# EAGLE design HMC5883L_Breakout-v14 (EAGLE 6.2)
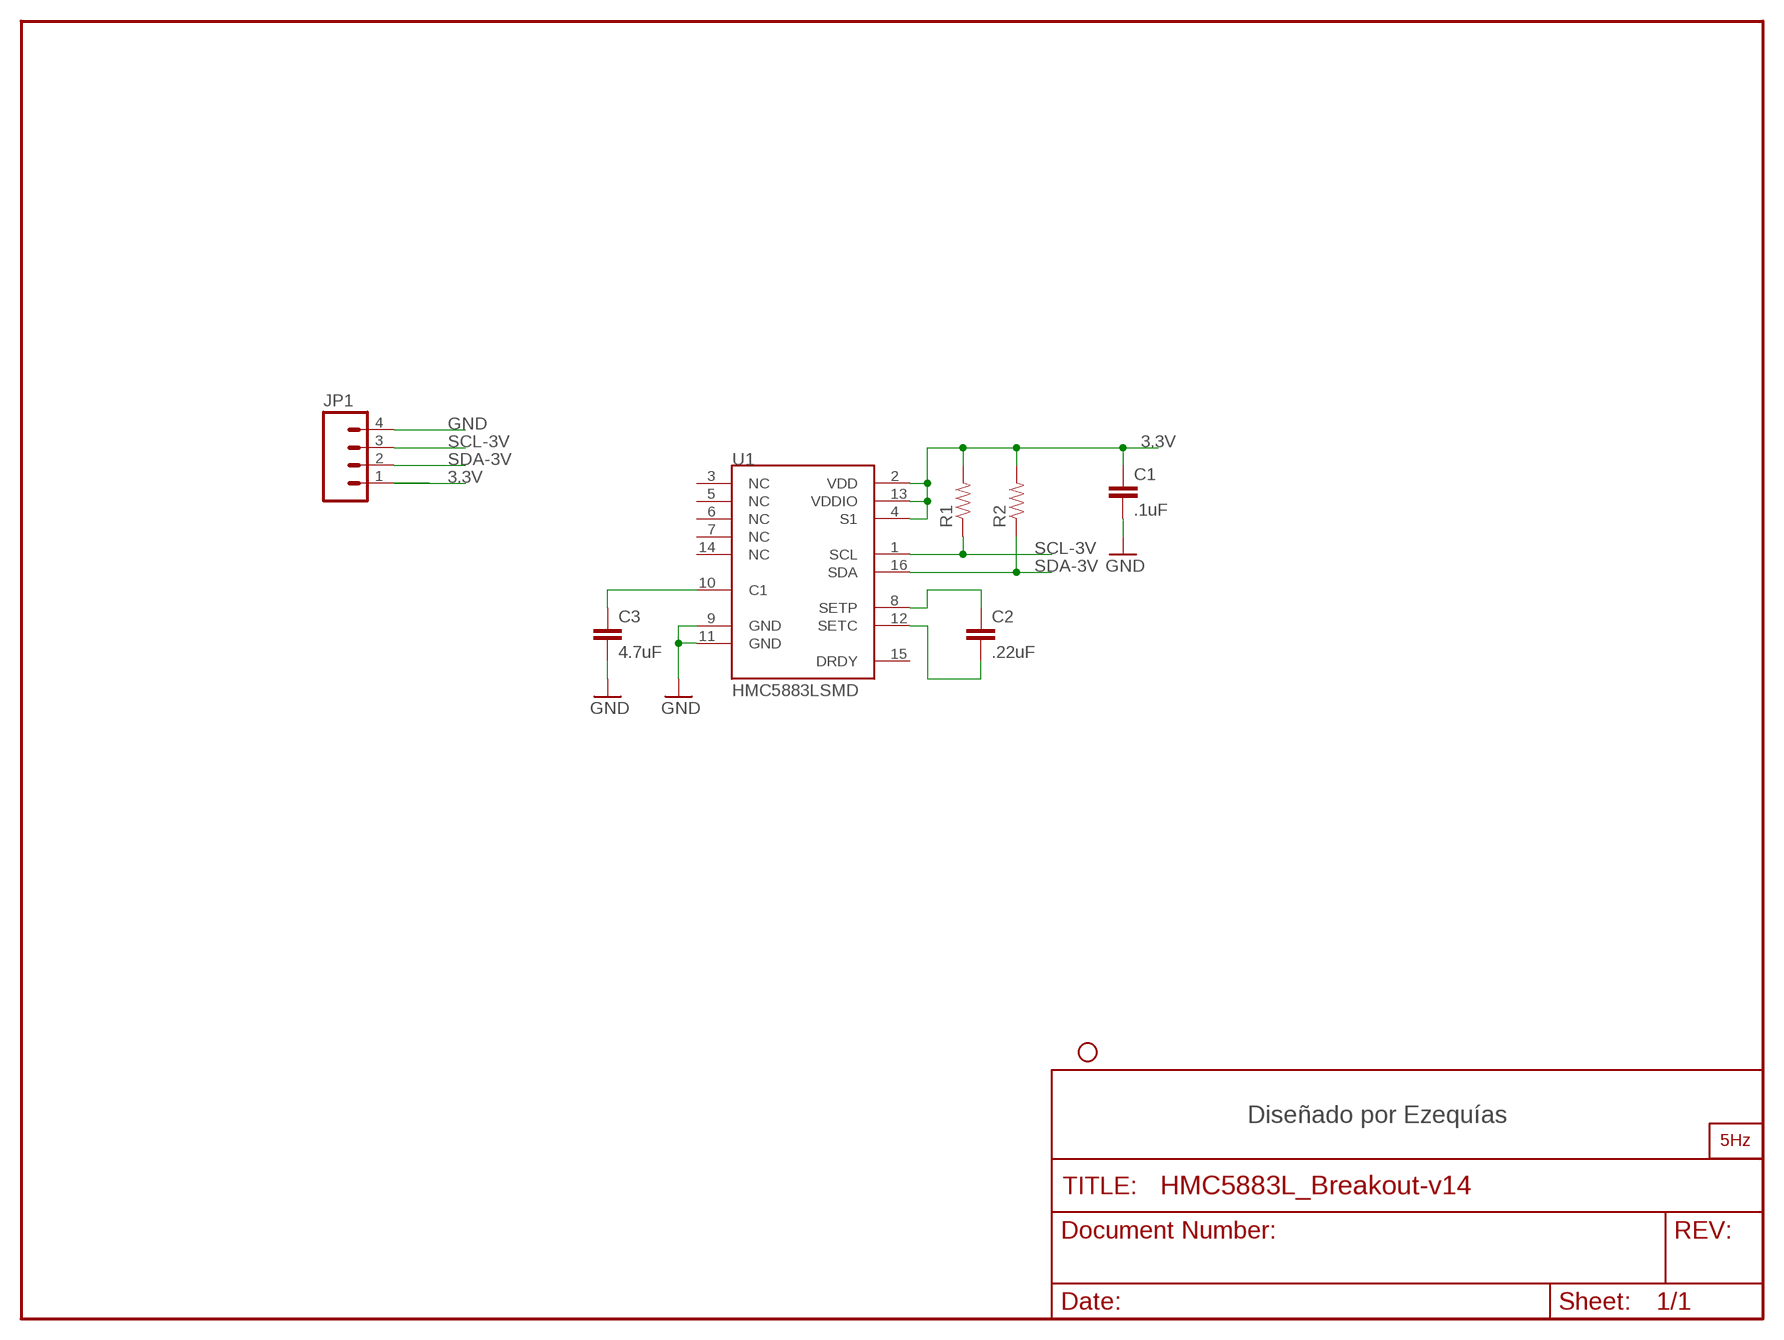
[diagram p0: schematic, sheet 1]

## Parts
C1  .1uF  CAP0603-CAP  [0603-CAP]
C2  .22uF  CAP0603-CAP  [0603-CAP]
C3  4.7uF  CAP0603-CAP  [0603-CAP]
JP1  M04PTH  [1X04]
JP4  STAND-OFF  [STAND-OFF]
R1  RESISTORPTH-1/6W  [1/6W-RES]
R2  RESISTORPTH-1/6W  [1/6W-RES]
U1  HMC5883LSMD  [16LPCC]
U$1  LOGO2_SILK5MM  [LOGO2_5MM]

## Nets
3.3V: C1.1 JP1.1 R1.2 R2.2 U1.2(VDD) U1.4(S1) U1.13(VDDIO)
GND: C1.2 C3.2 JP1.4 U1.9(GND) U1.11(GND)
N$1: C3.1 U1.10(C1)
N$4: C2.1 U1.8(SETP)
N$5: C2.2 U1.12(SETC)
SCL-3V: JP1.3 R1.1 U1.1(SCL)
SDA-3V: JP1.2 R2.1 U1.16(SDA)
Unconnected: U1.3(NC) U1.5(NC) U1.6(NC) U1.7(NC) U1.14(NC) U1.15(DRDY)

## Notes on the sheet
- Diseñado por Ezequías

## Library data of the parts
C1-C3 = SparkFun:CAP: Capacitor Standard 0603 ceramic capacitor, and 0.1" leaded capacitor.
JP1 = SparkFun:M04: Header 4 Standard 4-pin 0.1" header. Use with straight break away headers (SKU : PRT-00116), right angle break away headers (PRT-00553), swiss pins (PRT-00743), machine pins (PRT-00117), and female headers (PRT-00115). Molex polarized connector foot print use with SKU : PRT-08231 with associated crimp pins and housings. 1MM SMD Version SKU: PRT-10208
JP4 = SparkFun:STAND-OFF: Stand Off This is the mechanical footprint for a #4 phillips button head screw. Use the keepout ring to avoid running the screw head into surrounding components. SKU : PRT-00447
R1 R2 = SparkFun:RESISTOR: Resistor Basic schematic elements and footprints for 0603, 1206, and PTH resistors.
U1 = SparkFun:HMC5883L: 3 Axis Digital Compass IC
U$1 = LOGO:LOGO2_SILK: PRINCIPAL

## Net classes
1 vcc: width 0.305 mm

## Board
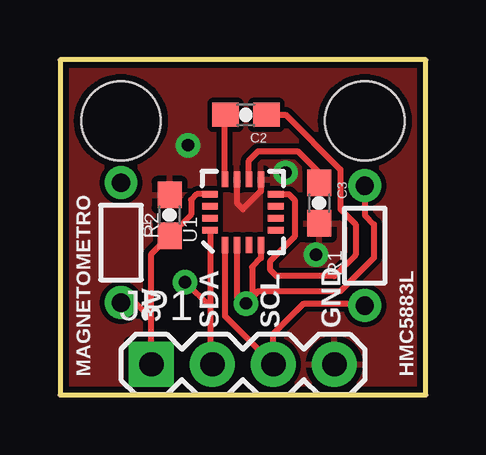
[diagram p1: board, top side]
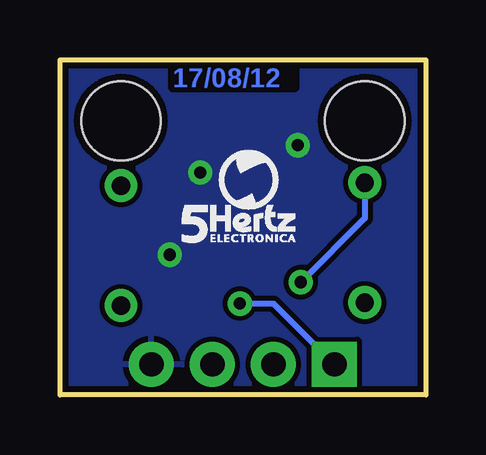
[diagram p2: board, bottom side, seen from below]

Size 15.24 x 13.97 mm. Coordinates in mm from the lower left corner, seen from the top.
Outline: 0,0 15.24,0 15.24,13.97 0,13.97 0,0
Copper layers (1*16): Top 0.035mm / dielectric 1.5mm / Bottom 0.035mm
Design rules: minimum track width 8mil, minimum drill 20mil, track to track 8mil, track to pad 8mil, pad to pad 8mil, via to via 8mil, smd to smd 8mil, copper to edge 10mil, drill to drill 8mil, minimum pad ring 12mil, minimum via ring 10mil, stop-mask expansion 4mil, vias tented up to drill 25mil, thermal gap 10mil

### Footprints (pad centres in the part's own frame; a part is rotated, then mirrored left to right if it is on the bottom)
0603-CAP = smd 1.1 x 1: 1 -0.85,0; 2 0.85,0
1X04 = drill 1.016 pad 1.88 square: 1 0,0 | drill 1.016 pad 1.88: 2 2.54,0; 3 5.08,0; 4 7.62,0
STAND-OFF = hole 3.302: 0,0
1/6W-RES = drill 0.762: 1 -2.5,0; 2 2.5,0
16LPCC = smd 0.65 x 0.28: 1 -1.37,0.75; 2 -1.37,0.25; 3 -1.37,-0.25; 4 -1.37,-0.75; 9 1.37,-0.75; 10 1.37,-0.25; 11 1.37,0.25; 12 1.37,0.75 | smd 0.28 x 0.65: 5 -0.75,-1.37; 6 -0.25,-1.37; 7 0.25,-1.37; 8 0.75,-1.37; 13 0.75,1.37; 14 0.25,1.37; 15 -0.25,1.37; 16 -0.75,1.37

### Placement (x,y rotation side)
C1  4.57,7.49 90 top
C2  7.75,11.68 180 top
C3  10.79,8 270 top
JP1  3.81,1.27 0 top
JP2  STAND-OFF  [STAND-OFF]  2.54,11.43 0 top
JP4  12.7,11.43 0 top
R1  12.7,6.22 90 top
R2  2.54,6.35 270 top
U1  7.62,7.62 90 top
U$1  10.16,6.35 0 bottom

### Tracks (layer width: path | path; a pad name or v marks a point on that pad's centre or on a via)
3.3V  (via drill 0.51)
  Top 0.254: JP1.1 3.81,3.17 | 3.81,3.17 3.81,5.88 C1.1 5.46,7.53 5.46,8.13 5.7,8.37 U1.13 | R2.2 3.13,3.85 3.81,3.17 | U1.2 7.37,4.06 v7.75,3.81 | R1.2 12.7,7.49 13.08,7.11 13.08,5.71 11.68,4.32 8.26,4.32 v7.75,3.81 | U1.4 8.37,5.7 8,5.33 8,4.06 v7.75,3.81
  Bottom 0.254: v7.75,3.81 6.35,3.81 JP1.1
GND  (via drill 0.51)
  Top 0.254: U1.9 8.37,8.5 7.62,7.75 7.37,8 U1.11
  other vias: 9.4,9.27 10.67,5.84 5.33,10.41
  pour Bottom: 0,13.97 0,0 15.24,0 15.24,13.97
  pour Top: 0,13.97 0,0 15.24,0 15.24,13.97
N$1
  Top 0.254: U1.10 7.87,9.78 8.26,10.16 9.91,10.16 10.79,9.27 C3.1
N$4
  Top 0.254: C2.1 9.4,11.68 11.68,9.4 11.68,7.75 12.32,7.11 12.32,5.84 11.43,4.95 9.02,4.95 8.76,5.21 8.76,5.59 9.78,6.6 9.78,8.13 9.54,8.37 U1.8
N$5
  Top 0.254: U1.12 6.87,11.66 C2.2
SCL-3V
  Top 0.254: U1.1 6.87,3.29 JP1.3 8.89,2.54 10.16,3.81 12.61,3.81 R1.1
SDA-3V  (via drill 0.51)
  Top 0.254: U1.16 6.25,3.68 | 6.25,3.68 6.25,1.37 JP1.2 | v5.21,4.7 6.25,3.68
  Bottom 0.254: R2.1 2.54,7.37 v5.21,4.7 | 6.25,1.37 JP1.2

### Text on the board
Bottom: 17/08/12
tPlace: 3V | SDA | SCL | GND | MAGNETOMETRO | HMC5883L